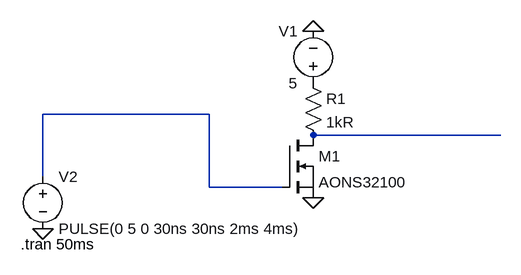
[diagram p0: schematic testspice.asc]
testspice.asc, the LTspice schematic file:
Version 4
SHEET 1 880 680
WIRE -32 -208 -288 -208
WIRE 416 -176 128 -176
WIRE -288 -112 -288 -208
WIRE -32 -96 -32 -208
WIRE 80 -96 -32 -96
FLAG 128 -80 0
FLAG 128 -336 0
FLAG -288 -32 0
SYMBOL voltage 128 -240 R180
WINDOW 0 24 96 Left 2
WINDOW 3 24 16 Left 2
WINDOW 123 0 0 Left 0
WINDOW 39 0 0 Left 0
SYMATTR InstName V1
SYMATTR Value 5
SYMBOL voltage -288 -128 R0
WINDOW 123 0 0 Left 0
WINDOW 39 0 0 Left 0
SYMATTR InstName V2
SYMATTR Value PULSE(0 5 0 30ns 30ns 2ms 4ms)
SYMBOL nmos 80 -176 R0
SYMATTR InstName M1
SYMATTR Value AONS32100
SYMBOL res 112 -272 R0
SYMATTR InstName R1
SYMATTR Value 1kR
TEXT -322 -8 Left 2 !.tran 50ms

The netlist it stands for:
* testspice.asc
V1 P001 0 5
V2 N001 0 PULSE(0 5 0 30ns 30ns 2ms 4ms)
M1 N002 N001 0 0 AONS32100
R1 P001 N002 1kR
.model NMOS NMOS
.model PMOS PMOS
.lib standard.mos
.tran 50ms
.backanno
.end